# EAGLE design ExternalStepperDriver (EAGLE 6.3)
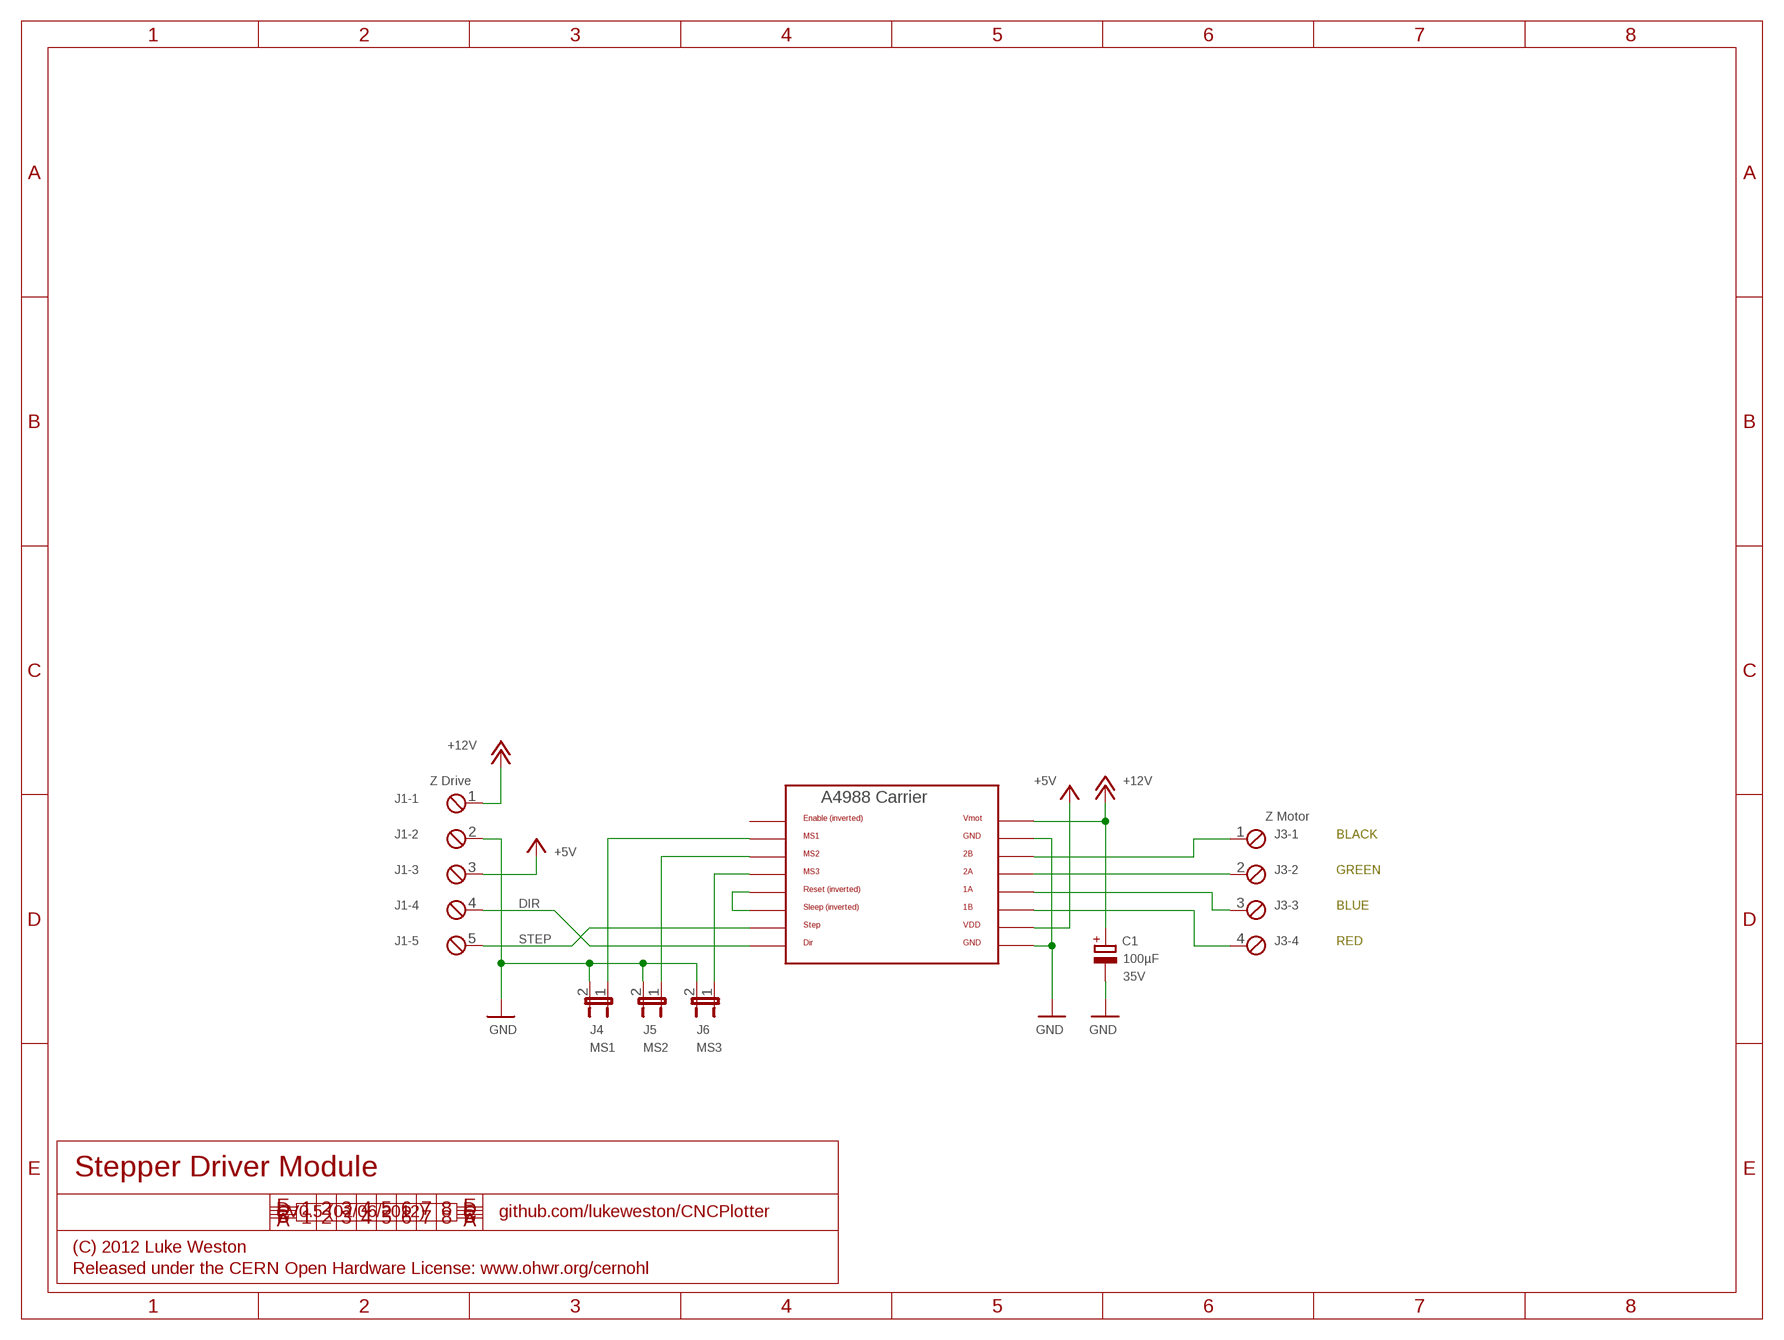
[diagram p0: schematic, sheet 1]

## Parts
C1  100µF  CPOL-EUE2.5-6  [E2,5-6]
J1  Z Drive  MPT5  [5POL254]
J2  A4988BREAKOUT  [A4988BREAKOUT]
J3  Z Motor  MPT4  [4POL254]
J4  MS1  JP1E  [JP1]
J5  MS2  JP1E  [JP1]
J6  MS3  JP1E  [JP1]

## Nets
+5V: J1.3 J2.VDD
+12V: C1.+ J1.1 J2.VMOT
DIR: J1.4 J2.DIR
GND: C1.- J1.2 J2.GND J2.GND@0(GND) J4.2 J5.2 J6.2
N$1: J2.MS1 J4.1
N$2: J2.MS2 J5.1
N$3: J2.MS3 J6.1
N$4: J2.RST J2.SLP(SLEEP)
N$79: J2.2B J3.1
N$80: J2.1B J3.4
N$81: J2.1A J3.3
N$82: J2.2A J3.2
STEP: J1.5 J2.STEP
Unconnected: J2.EN

## Notes on the sheet
- BLACK
- GREEN
- BLUE
- RED
- Stepper Driver Module
- V0.5 (02/06/2012) | github.com/lukeweston/CNCPlotter
- (C) 2012 Luke Weston
- Released under the CERN Open Hardware License: www.ohwr.org/cernohl

## Library data of the parts
C1 = rcl:CPOL-EU: POLARIZED CAPACITOR, European symbol; VOLTAGE: 35V
J1 = con-phoenix-254:MPT5: PHOENIX CONNECTOR; OC_FARNELL: unknown; OC_NEWARK: unknown
J2 = RepRapjr:A4988BREAKOUT
J3 = con-phoenix-254:MPT4: PHOENIX CONNECTOR; OC_FARNELL: unknown; OC_NEWARK: unknown
J4-J6 = jumper:JP1E: JUMPER

## Board
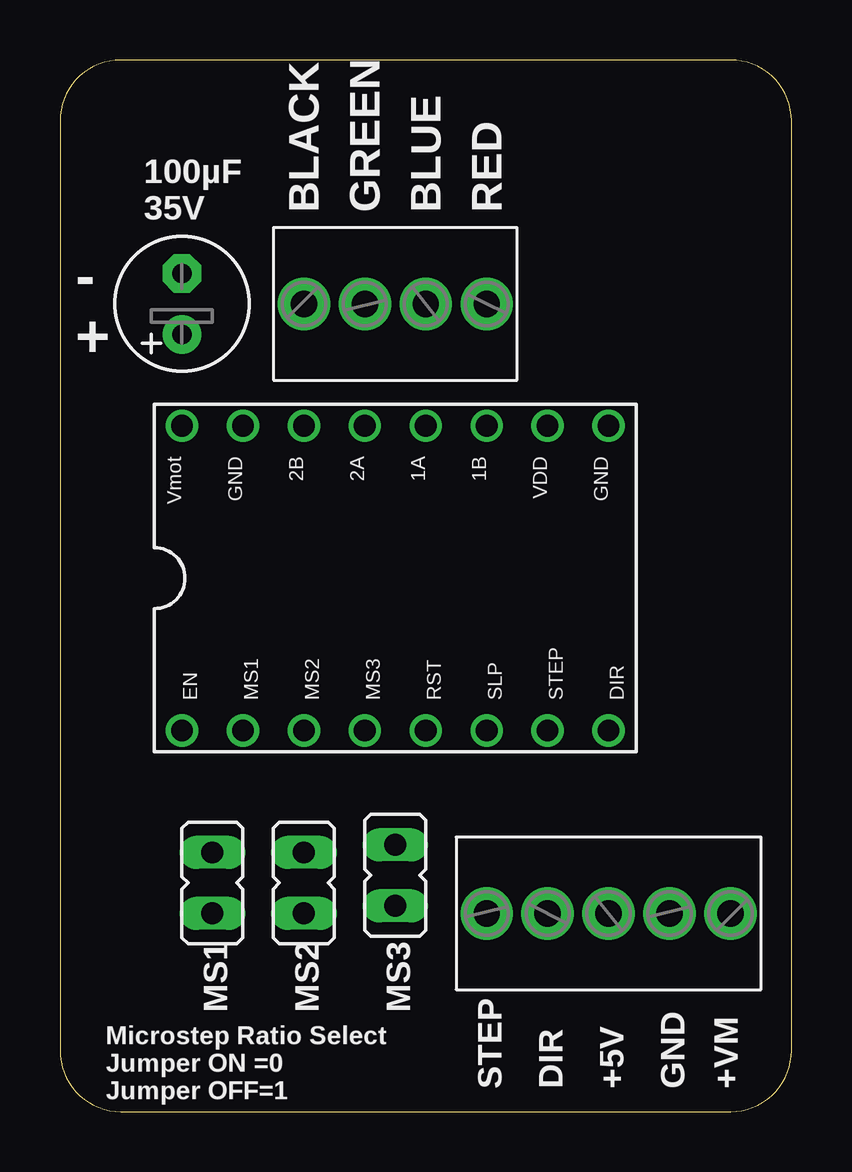
[diagram p1: board, top side]
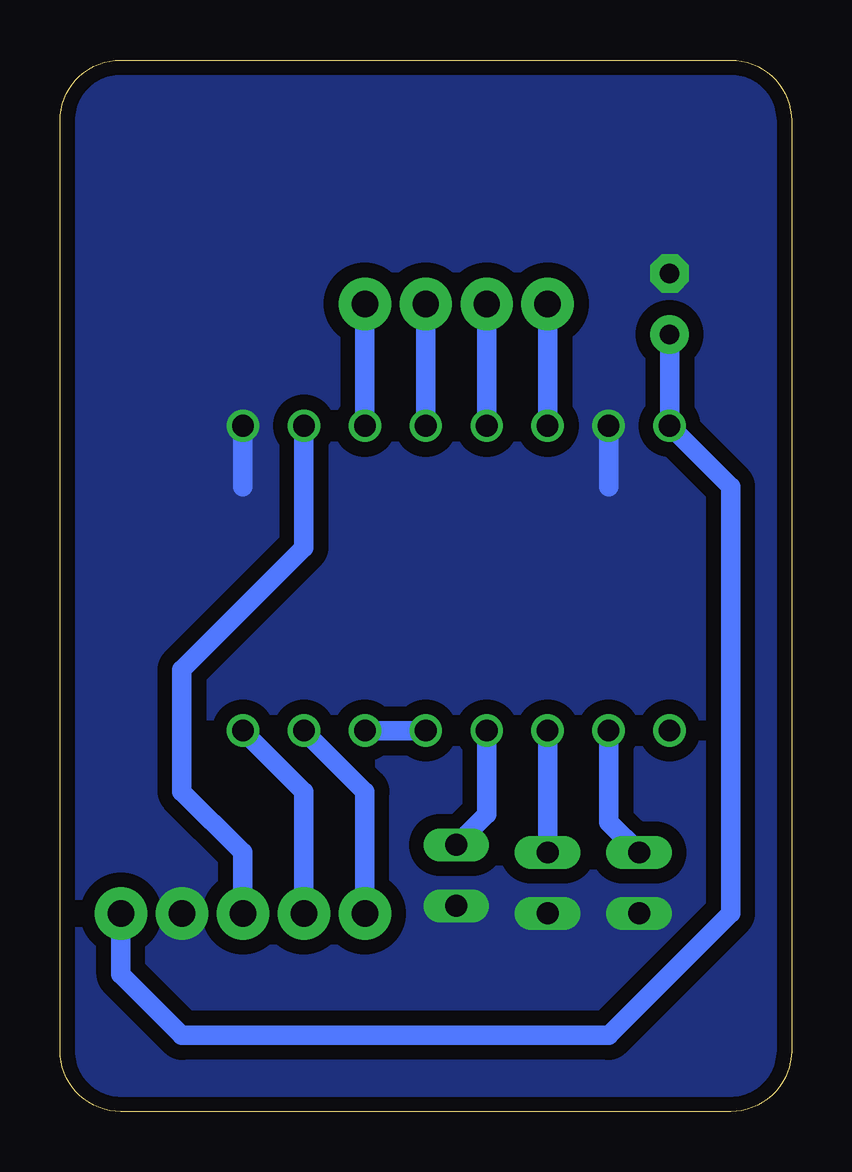
[diagram p2: board, bottom side, seen from below]

Size 30.48 x 43.81 mm. Coordinates in mm from the lower left corner, seen from the top.
Outline: 2.54,0 27.94,0 arc90 30.48,2.54 30.48,41.27 arc90 27.94,43.81 2.54,43.81 arc90 0,41.27 0,2.54 arc90 2.54,0
Copper layers (1*16): Top 0.035mm / dielectric 1.5mm / Bottom 0.035mm
Design rules "default": minimum track width 8mil, minimum drill 0.4mm, track to track 8mil, track to pad 8mil, pad to pad 8mil, via to via 8mil, smd to smd 8mil, copper to edge 20mil, drill to drill 8mil, minimum pad ring 8mil, minimum via ring 10mil, stop-mask expansion 3mil, vias tented up to drill 25mil, thermal gap 8mil

### Footprints (pad centres in the part's own frame; a part is rotated, then mirrored left to right if it is on the bottom)
E2,5-6 = drill 0.813 pad 1.6: + -1.27,0 | drill 0.813 pad 1.6 octagon: - 1.27,0
5POL254 = drill 1.1 pad 2.184: 1 -5.08,0; 2 -2.54,0; 3 0,0; 4 2.54,0; 5 5.08,0
A4988BREAKOUT = drill 0.9: 1A 8.89,1.27; 1B 11.43,1.27; 2A 6.35,1.27; 2B 3.81,1.27; DIR 16.51,-11.43; EN -1.27,-11.43; GND 16.51,1.27; GND@0 1.27,1.27; MS1 1.27,-11.43; MS2 3.81,-11.43; MS3 6.35,-11.43; RST 8.89,-11.43; SLP 11.43,-11.43; STEP 13.97,-11.43; VDD 13.97,1.27; VMOT -1.27,1.27
4POL254 = drill 1.1 pad 2.184: 1 -3.81,0; 2 -1.27,0; 3 1.27,0; 4 3.81,0
JP1 = drill 0.914 long: 1 0,-1.27; 2 0,1.27

### Placement (x,y rotation side)
C1  5.08,33.66 90 top
J1  22.86,8.26 180 top
J2  6.35,27.3 0 top
J3  13.97,33.66 0 top
J4  6.35,9.53 180 top
J5  10.16,9.53 180 top
J6  13.97,9.84 180 top

### Tracks (layer width: path | path; a pad name or v marks a point on that pad's centre or on a via)
+5V
  Bottom 0.813: J2.VDD 20.32,23.5 25.4,18.41 25.4,13.34 22.86,10.79 J1.3
+12V
  Bottom 0.813: C1.+ J2.VMOT 2.54,26.04 2.54,8.26 7.62,3.17 25.4,3.17 27.94,5.71 J1.1
DIR
  Bottom 0.813: J1.4 20.32,13.34 J2.DIR
GND
  Bottom 0.813: J2.GND@0 7.62,26.04 | 22.86,26.04 J2.GND
  pour Bottom (isolate 0.61, no thermals): 0,43.81 30.48,43.81 30.48,0 0,0
N$1
  Bottom 0.813: J2.MS1 7.62,12.06 J4.1
N$2
  Bottom 0.813: J2.MS2 J5.1
N$3
  Bottom 0.813: J2.MS3 12.7,12.38 J6.1
N$4
  Bottom 0.813: J2.SLP J2.RST
N$79
  Bottom 0.813: J3.1 J2.2B
N$80
  Bottom 0.813: J3.4 J2.1B
N$81
  Bottom 0.813: J3.3 J2.1A
N$82
  Bottom 0.813: J3.2 J2.2A
STEP
  Bottom 0.813: J1.5 17.78,13.34 J2.STEP

### Text on the board
tPlace: 100µF / 35V | BLACK | GREEN | BLUE | RED | - | + | MS1 | MS2 | MS3 | STEP | DIR | +5V | GND | +VM | Microstep Ratio Select / Jumper ON =0 / Jumper OFF=1